# Altium schematic sheet HBridgeInterface.SchDoc
size A4; SheetNumber: 2; SheetTotal: 2
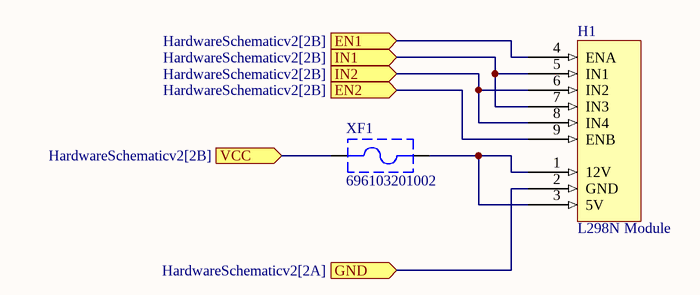
[diagram p0: HBridgeInterface.SchDoc]

## Parts
H1  L298N Module  [New footprint 1]
XF1  696103201002  [696103201002]

## Ports
EN1 (in, see HardwareSchematicv2[2B]), EN2 (in, see HardwareSchematicv2[2B]), GND (in, see HardwareSchematicv2[2A]), IN1 (in, see HardwareSchematicv2[2B]), IN2 (in, see HardwareSchematicv2[2B]), VCC (in, see HardwareSchematicv2[2B])

## Nets
EN1: H1.4(ENA) ; port EN1
EN2: H1.9(ENB) ; port EN2
GND: H1.2(GND) ; port GND
IN1: H1.5(IN1) H1.7(IN3) ; port IN1
IN2: H1.6(IN2) H1.8(IN4) ; port IN2
VCC: XF1.1 ; port VCC
NetH1_1: H1.1(12V) H1.3(5V) XF1.2

## Library data of the parts
H1 = L298N_Board-2: Direct conector for H-Bridge
XF1 = CMP-1502-00239-2: NexarPartId: 82221271; Packaging: Box; RoHS: Non-Compliant